# Altium schematic sheet Estimador.SchDoc
size A4; DocumentNumber: 5; SheetNumber: 5; SheetTotal: 7
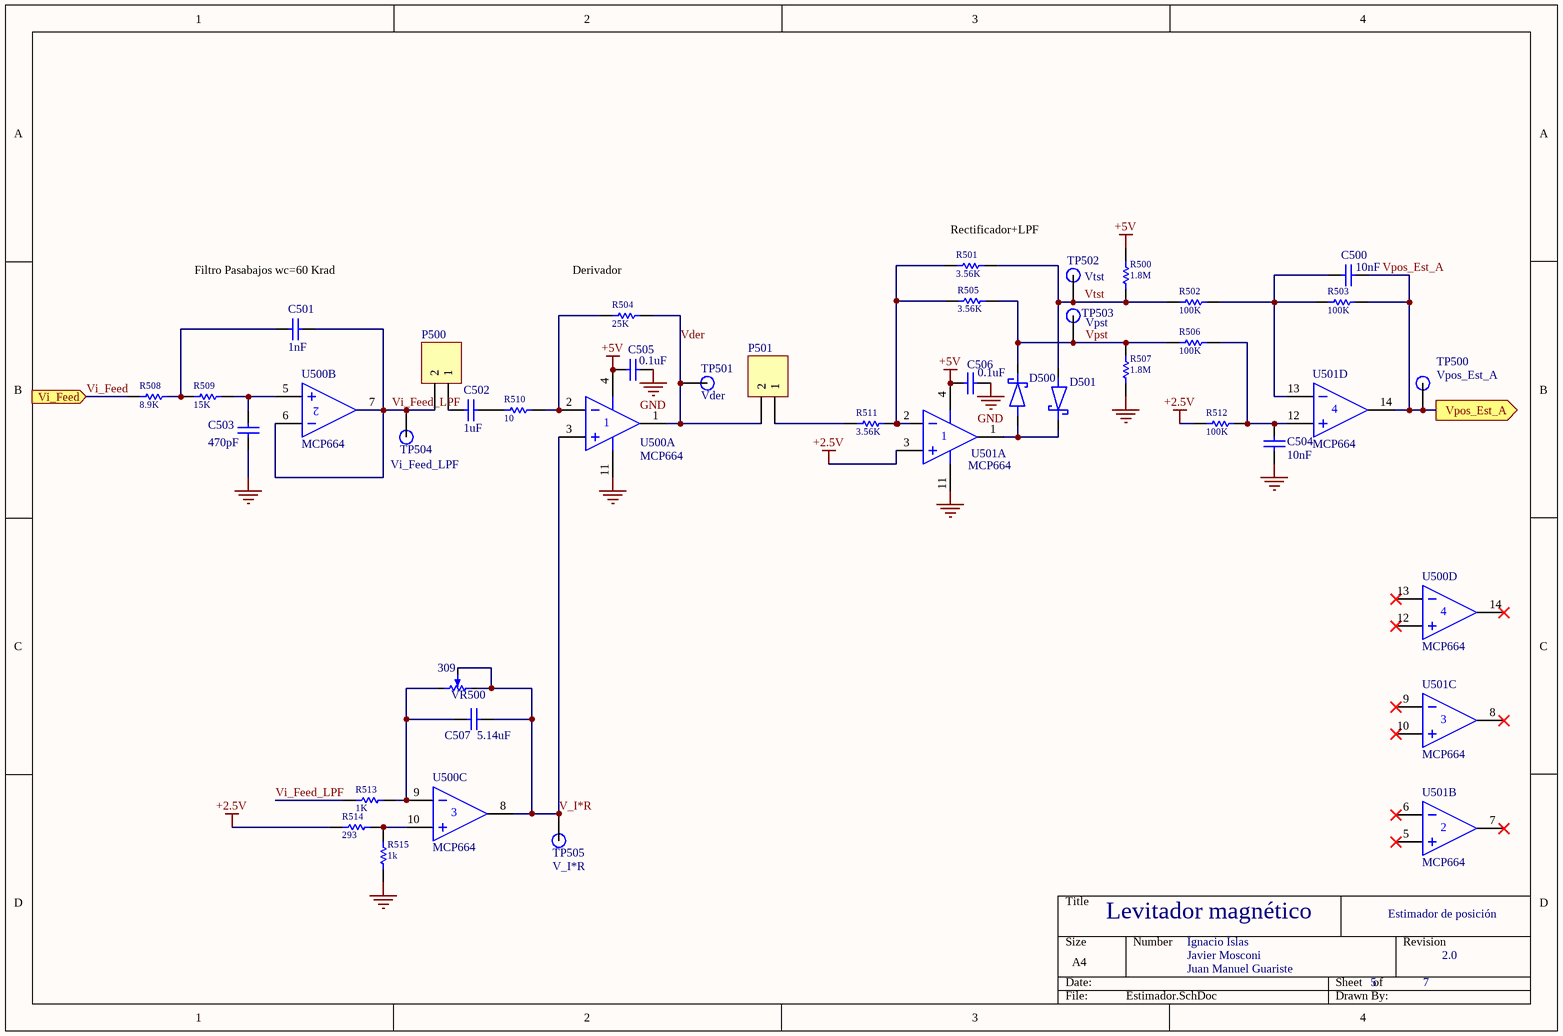
[diagram p0: Estimador.SchDoc]

## Parts
C500  value 10nF  [C1206]  (hidden comment: Capacitor)
C501  value 1nF  [C1206]  (hidden comment: Capacitor)
C502  value 1uF  [C1206]  (hidden comment: Capacitor)
C503  value 470pF  [C1206]  (hidden comment: Capacitor)
C504  value 10nF  [C1206]  (hidden comment: Capacitor)
C505  value 0.1uF  [C1206]  (hidden comment: Capacitor)
C506  value 0.1uF  [C1206]  (hidden comment: Capacitor)
C507  value 5.14uF  [C1206]  (hidden comment: Capacitor)
D500  RSX205LAM30TR  [SODFL4725X105N]  (value not drawn)
D501  RSX205LAM30TR  [SODFL4725X105N]  (value not drawn)
P500  Header 2  [HDR1X2]  (value not drawn)
P501  Header 2  [HDR1X2]  (value not drawn)
R500  1.8M  [R1206]
R501  3.56K  [R1206]
R502  100K  [R1206]
R503  100K  [R1206]
R504  25K  [R1206]
R505  3.56K  [R1206]
R506  100K  [R1206]
R507  1.8M  [R1206]
R508  8.9K  [R1206]
R509  15K  [R1206]
R510  10  [R1206]
R511  3.56K  [R1206]
R512  100K  [R1206]
R513  1K  [R1206]
R514  293  [R1206]
R515  1k  [R1206]
TP500  Vpos_Est_A  [TestPoint Keystone 5000 Silver-Red]
TP501  Vder  [TestPoint Keystone 5000 Silver-Red]
TP502  Vtst  [TestPoint Keystone 5000 Silver-Red]
TP503  Vpst  [TestPoint Keystone 5000 Silver-Red]
TP504  Vi_Feed_LPF  [TestPoint Keystone 5000 Silver-Red]
TP505  V_I*R  [TestPoint Keystone 5000 Silver-Red]
U500  MCP664  [SOIC14]  (parts A,B,C,D of 4)
U501  MCP664  [SOIC14]  (parts A,B,C,D of 4)
VR500  value 309  [3299Y1203LF]  (hidden comment: Trimmer (Thru-Hole))

## Ports
Vi_Feed (in), Vpos_Est_A (out)

## Nets
+2.5V: R512.2 R514.1 U501.3(IN+)
+5V: C505.1 C506.1 R500.2 U500.4(V+) U501.4(V+)
GND: C503.2 C504.1 C505.2 C506.2 R507.1 R515.1 U500.11(V-) U501.11(V-)
V_I*R: C507.1 TP505.1 U500.3(IN+) U500.8(OUT) VR500.2(W) VR500.3(CW)
Vder: P501.2 R504.2 TP501.1 U500.1(OUT)
Vi_Feed: R508.1 ; port Vi_Feed
Vi_Feed_LPF: C501.1 P500.2 R513.1 TP504.1 U500.6(IN-) U500.7(OUT)
Vpos_Est_A: C500.1 R503.1 TP500.1 U501.14(OUT) ; port Vpos_Est_A
Vpst: D500.1(K) R505.2 R506.1 R507.2 TP503.1
Vtst: D501.2(A) R500.1 R501.2 R502.1 TP502.1
NetC500_2: C500.2 R502.2 R503.2 U501.13(IN-)
NetC501_2: C501.2 R508.2 R509.1
NetC502_1: C502.1 P500.1
NetC502_2: C502.2 R510.1
NetC503_1: C503.1 R509.2 U500.5(IN+)
NetC504_2: C504.2 R506.2 R512.1 U501.12(IN+)
NetC507_2: C507.2 R513.2 U500.9(IN-) VR500.1(CCW)
NetD500_2: D500.2(A) D501.1(K) U501.1(OUT)
NetP501_1: P501.1 R511.1
NetR501_1: R501.1 R505.1 R511.2 U501.2(IN-)
NetR504_1: R504.1 R510.2 U500.2(IN-)
NetR514_2: R514.2 R515.2 U500.10(IN+)

Not connected (* = marked no-connect by the designer): U500 12(IN+)* 13(IN-)* 14(OUT)*; U501 5(IN+)* 6(IN-)* 7(OUT)* 8(OUT)* 9(IN-)* 10(IN+)*

## Notes on the sheet
- (near R501) Rectificador+LPF
- (near C501) Filtro Pasabajos wc=60 Krad
- (near R504) Derivador
- Levitador magnético
- Estimador de posición
- Ignacio Islas
- Javier Mosconi
- Juan Manuel Guariste
- 2.0

## Library data of the parts
C500 C504 = Capacitor: CAP CER 10000PF 500V X7R 1206; Manufacturer: KEMET; Mfr PN: C1206C103KCRAC7800; Supplier 1: Digi-Key; Supplier 1 PN: 399-C1206C103KCRAC7800CT-ND
C501 = Capacitor: CAP CER 1000PF 2KV X7R 1206; Mfr PN: 202R18W102KV4E; Manufacturer: Johanson Dielectrics Inc.; Supplier 1: Digi-Key; Supplier 1 PN: 709-1036-1-ND
C502 = Capacitor: CAP CER 1UF 25V X7R 1206; Manufacturer: CAL-CHIP ELECTRONICS, INC.; Mfr PN: GMC31X7R105M25NT; Supplier 1: Digi-Key; Supplier 1 PN: 2571-GMC31X7R105M25NTTR-ND
C503 = Capacitor: CAP CER 470PF 1KV C0G/NP0 1206; Manufacturer: Samsung Electro-Mechanics; Mfr PN: CL31C471JIHNNNE; Supplier 1: Digi-Key; Supplier 1 PN: 1276-3279-1-ND
C505 C506 = Capacitor: CAP CER 0.1UF 50V X7R 1206; Mfr PN: C1206X7R500-104KNE; Manufacturer: Venkel; Supplier 1: Digi-Key; Supplier 1 PN: 2679-C1206X7R500-104KNETR-ND
C507 = Capacitor: CAP CER 5100PF 100V NP0 5% 1206; Mfr PN: C1206C512J1GAC7800; Manufacturer: KEMET; Supplier 1: Digi-Key; Supplier 1 PN: 399-16393-1-ND
D500 D501 = RSX205LAM30TR: DIODE SCHOTTKY 30V 2A PMDTM; Manufacturer: ROHM Semiconductor; Mfr PN: RSX205LAM30TR; Supplier 1: Digi-Key; Supplier 1 PN: RSX205LAM30CT-ND
P500 P501 = Header 2: TERM BLK 2P SIDE ENT 2.54MM PCB; Manufacturer: TE Connectivity AMP Connectors; Mfr PN: 282834-2; Link: https://www.digikey.com/en/products/detail/te-connectivity-amp-connectors/282834-2/1150135; Supplier 1: Digi-Key; Supplier 1 PN: A98333-ND
R500 R507 = R1206: RES 1.8M OHM 1% 1/4W 1206; Mfr PN: RC1206FR-071M8L; Manufacturer: YAGEO; Supplier 1 PN: 311-1.80MFRCT-ND; Supplier 1: Digi-Key; Value: 1.8M; Tolerance: 1%
R501 R505 R511 = R1206: RES 3.57K OHM 1% 1/4W 1206; Mfr PN: RC1206FR-073K57L; Manufacturer: YAGEO; Supplier 1 PN: 311-3.57KFRCT-ND; Supplier 1: Digi-Key; Value: 3.56K; Tolerance: 1%
R502 R503 R506 R512 = R1206: RES 100K OHM 1% 1/4W 1206; Mfr PN: RMCF1206FT100K; Manufacturer: Stackpole Electronics Inc; Supplier 1 PN: RMCF1206FT100KCT-ND; Supplier 1: Digi-Key; Value: 100K; Tolerance: 1%
R504 = R1206: RES SMD 25K OHM 1% 1/4W 1206; Mfr PN: Y163025K0000F0W; Manufacturer: Vishay Foil Resistors (Division of Vishay Precision Group); PackageReference: 1206; Supplier 1 PN: Y163025K0000F0W-ND; Supplier 1: Digi-Key; Value: 25K; Tolerance: 1%
R508 = R1206: RES 8.87K OHM 1% 1/4W 1206; Mfr PN: RC1206FR-078K87L; Manufacturer: YAGEO; PackageReference: 1206; Supplier 1 PN: 311-8.87KFRCT-ND; Supplier 1: Digi-Key; Value: 8.9K; Tolerance: 1%
R509 = R1206: RES 15K OHM 1% 1/4W 1206; Mfr PN: CRCW120615K0FKEAC; Manufacturer: Vishay Dale; Supplier 1 PN: 541-CRCW120615K0FKEACCT-ND; PackageReference: 1206; Supplier 1: Digi-Key; Value: 15K; Tolerance: 1%
R510 = R1206: RES 10 OHM 1% 1/4W 1206; Mfr PN: RMCF1206FT10R0; Manufacturer: Stackpole Electronics Inc; Supplier 1 PN: RMCF1206FT10R0CT-ND; Supplier 1: Digi-Key; Value: 10; Tolerance: 1%
R513 R515 = R1206: RES 1K OHM 1% 1/4W 1206; Mfr PN: RMCF1206FT1K00; Manufacturer: Stackpole Electronics Inc; Supplier 1 PN: RMCF1206FT1K00CT-ND; Supplier 1: Digi-Key; Tolerance: 1%
  R513: Value: 1K
  R515: Value: 1k
R514 = R1206: RES SMD 294 OHM 1% 1/4W 1206; Mfr PN: CRCW1206294RFKEA; Manufacturer: Vishay Dale; Supplier 1 PN: 541-294FCT-ND; Supplier 1: Digi-Key; Tolerance: 1%; Value: 293
TP500-TP505 = Testpoint: PC TEST POINT MINIATURE RED; Manufacturer: Keystone Electronics; Mfr PN: 5000; Link: https://www.digikey.com/en/products/detail/keystone-electronics/5000/255326; Supplier 1: Digi-Key; Supplier 1 PN: 36-5000-ND
U500 U501 = MCP664: IC OPAMP GP 4 CIRCUIT 14TSSOP; Mfr PN: MCP664-E/ST; Manufacturer: Microchip Technology; Datasheet: https://ar.mouser.com/datasheet/2/268/20002194E-2448650.pdf; Supplier 1: Digi-Key; Supplier 1 PN: MCP664-E/ST-ND
VR500 = Trimmer: TRIMMER 500 OHM 0.5W PC PIN TOP; Mfr PN: 3299Y-1-501LF; Manufacturer: Bourns Inc.; Supplier 1: Digi-Key; Supplier 1 PN: 3299Y-501LF-ND